# Altium schematic sheet acoplador_75_50.SchDoc
size A4; Date: 07/04/2022; Author: Wesley M. Cantarino; SheetNumber: 1; SheetTotal: 2
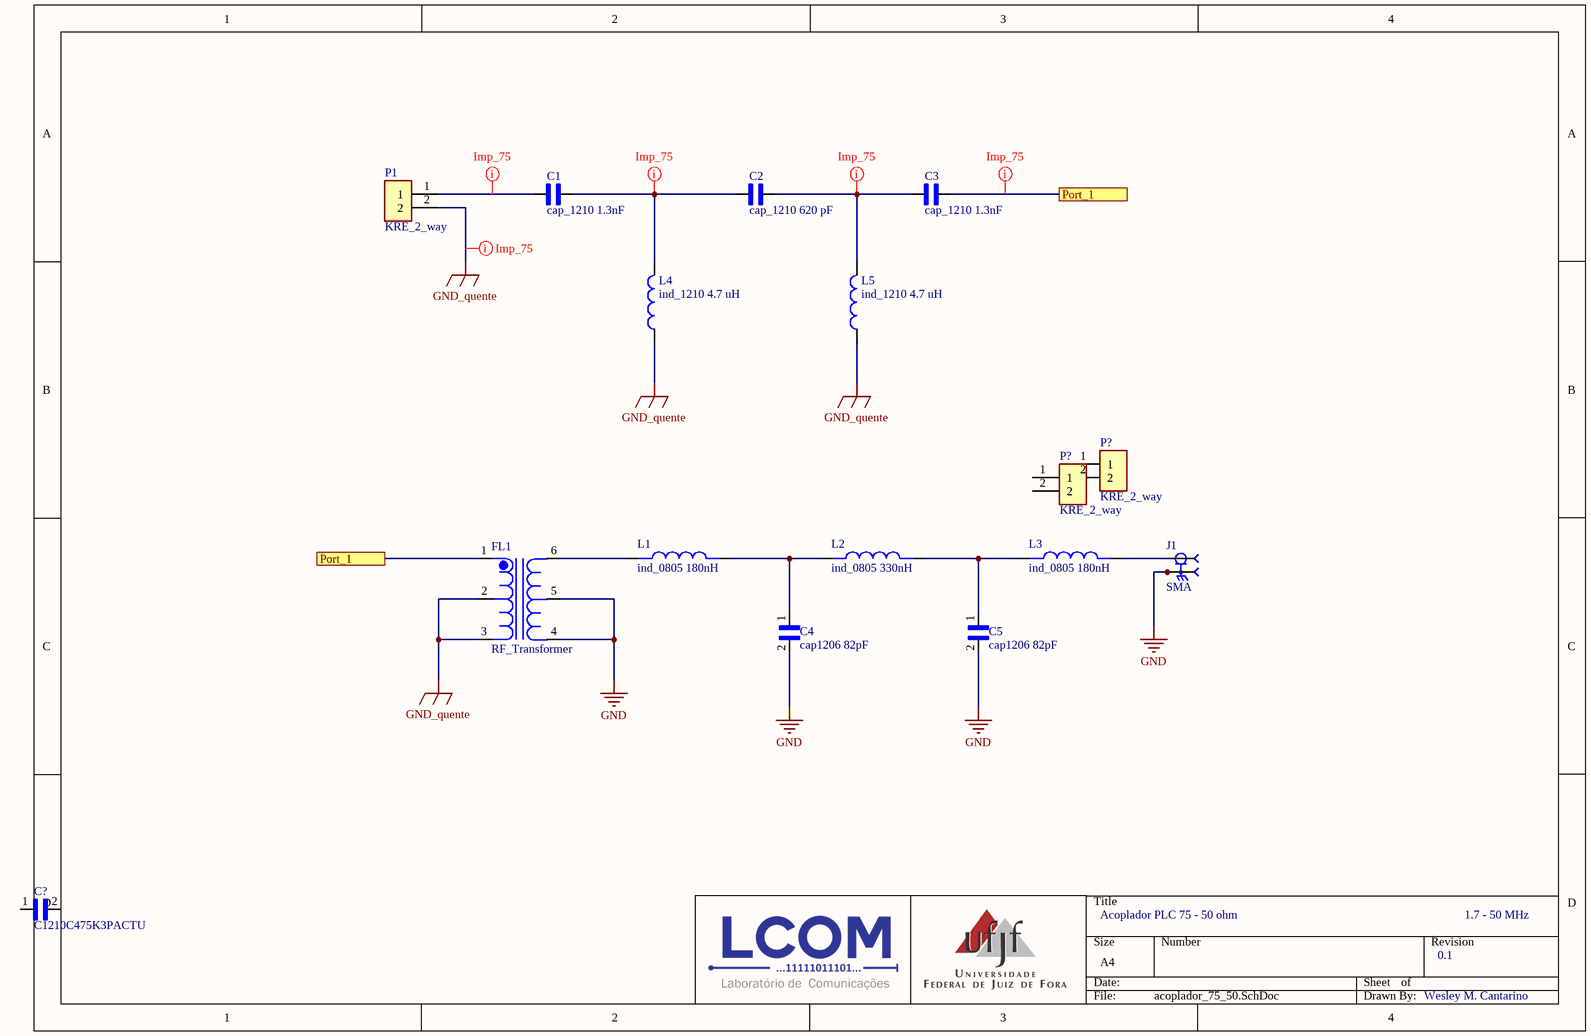
[diagram p0: acoplador_75_50.SchDoc]

## Parts
(Parts that share a designator on the sheet are numbered #1, #2 ... from top to bottom, then left to right.)
C1  cap_1210 1.3nF  [CAPC3225X200N]
C2  cap_1210 620 pF  [CAPC3225X200N]
C3  cap_1210 1.3nF  [CAPC3225X200N]
C4  cap1206 82pF  [CAPC3216X160N]
C5  cap1206 82pF  [CAPC3216X160N]
C?  C1210C475K3PACTU  [CAPC3225X140N]
FL1  RF_Transformer  [FIL_KA4909-AL]
J1  SMA  [JOHNSON_142-0701-201]
L1  ind_0805 180nH  [IND_ASMCI-0805-4R7M-T]
L2  ind_0805 330nH  [IND_ASMCI-0805-4R7M-T]
L3  ind_0805 180nH  [IND_ASMCI-0805-4R7M-T]
L4  ind_1210 4.7 uH  [INDC3225X120N]
L5  ind_1210 4.7 uH  [INDC3225X120N]
P1  KRE_2_way  [TE_282837-2]
P?#1  KRE_2_way  [TE_282837-2]
P?#2  KRE_2_way  [TE_282837-2]

## Ports
Port_1

## Nets
GND: C4.2 C5.2 FL1.4 FL1.5 J1.2 J1.3 J1.4 J1.5
GND_quente: FL1.2 FL1.3 L4.1 L5.1 P1.2
Port_1: C3.2 FL1.1 ; port Port_1
NetC1_1: C1.1 P1.1
NetC1_2: C1.2 C2.1 L4.2
NetC2_2: C2.2 C3.1 L5.2
NetC4_1: C4.1 L1.2 L2.1
NetC5_1: C5.1 L2.2 L3.1
NetFL1_6: FL1.6 L1.1
NetJ1_1: J1.1 L3.2

Not connected (* = marked no-connect by the designer): C? 1 2; P?#1 1 2; P?#2 1 2

## Layout directives
net class imp_75: GND_quente, NetC1_1, NetC1_2, NetC2_2, Port_1

## Notes on the sheet
- Acoplador PLC 75 - 50 ohm
- 1.7 - 50 MHz
- 0.1
- Wesley M. Cantarino

## Library data of the parts
C1-C3 = cap_1210: CAPACITOR, X7T, 33NF; Capacitance:33000pF; Capacitance Tolerance:Â± 10%; Dielectric Characteristic:X7T; Voltage Rating:630V; Capacitor Case Style:1210 [3225 Metric]; Operating Temperature Min:-55Â°C; Operating Temperature Max:125Â°C; Packaging:Cut Tape; SVHC:No SVHC (19-Dec-2012); Capacitor Terminals:SMD; Operating Temperature Range:-55Â°C to +125Â°C; MF: {'manufacturer': u'Murata Electronics'}; MP: GR332DD72J333KW01L; Package: None; Availability: Unavailable; Value: *; Price: None
C4 C5 = cap1206: MF: {'manufacturer': u'Syfer'}; MP: 1206J2K00820JCT; Package: None; Availability: Unavailable; Value: *; Price: None
C? = C1210C475K3PACTU: Cap Ceramic 4.7uF 25V X5R 10% SMD 1210 85C Plastic T/R; MF: {'manufacturer': u'Kemet'}; Availability: Unavailable; Price: None; Package: None; Value: *; MP: C1210C475K3PACTU
FL1 = RF_Transformer: Bias Injection Choke PWB 1.5 AL 30k 300M 1:1.5; MF: {'manufacturer': u'Coilcraft'}; MP: KA4909-AL; Package: None; Availability: Unavailable; Value: *; Price: None
J1 = SMA: Johnson Components 142-0701-201 / Conn Recept Straight Pcb .155""; MF: {'manufacturer': u'Cinch Connectivity Solutions Johnson'}; Package: None; Availability: Unavailable; Value: *; MP: 142-0701-201; Price: None
L1-L3 = ind_0805: MF: {'manufacturer': u'Abracon'}; MP: ASMCI-0805-4R7M-T; Package: None; Availability: Unavailable; Value: *; Price: None
L4 L5 = ind_1210: Ind Metal Alloy Shielded 1.5uH 20% 1MHz Powdered Iron 2.6A 1210 T/R; MP: 1277AS-H-1R5M=P2; MF: {'manufacturer': u'Murata Electronics'}; Value: *; Package: None; Availability: Unavailable; Price: None
P1 P?#1 P?#2 = KRE_2_way: TERM BLOCK 5.08MM 2POS SIDE ENTY; MP: 282837-2; MF: {'manufacturer': u'TE Connectivity'}; Value: *; Package: None; Availability: Unavailable; Price: None